# Altium schematic sheet GSM.SchDoc
size A3
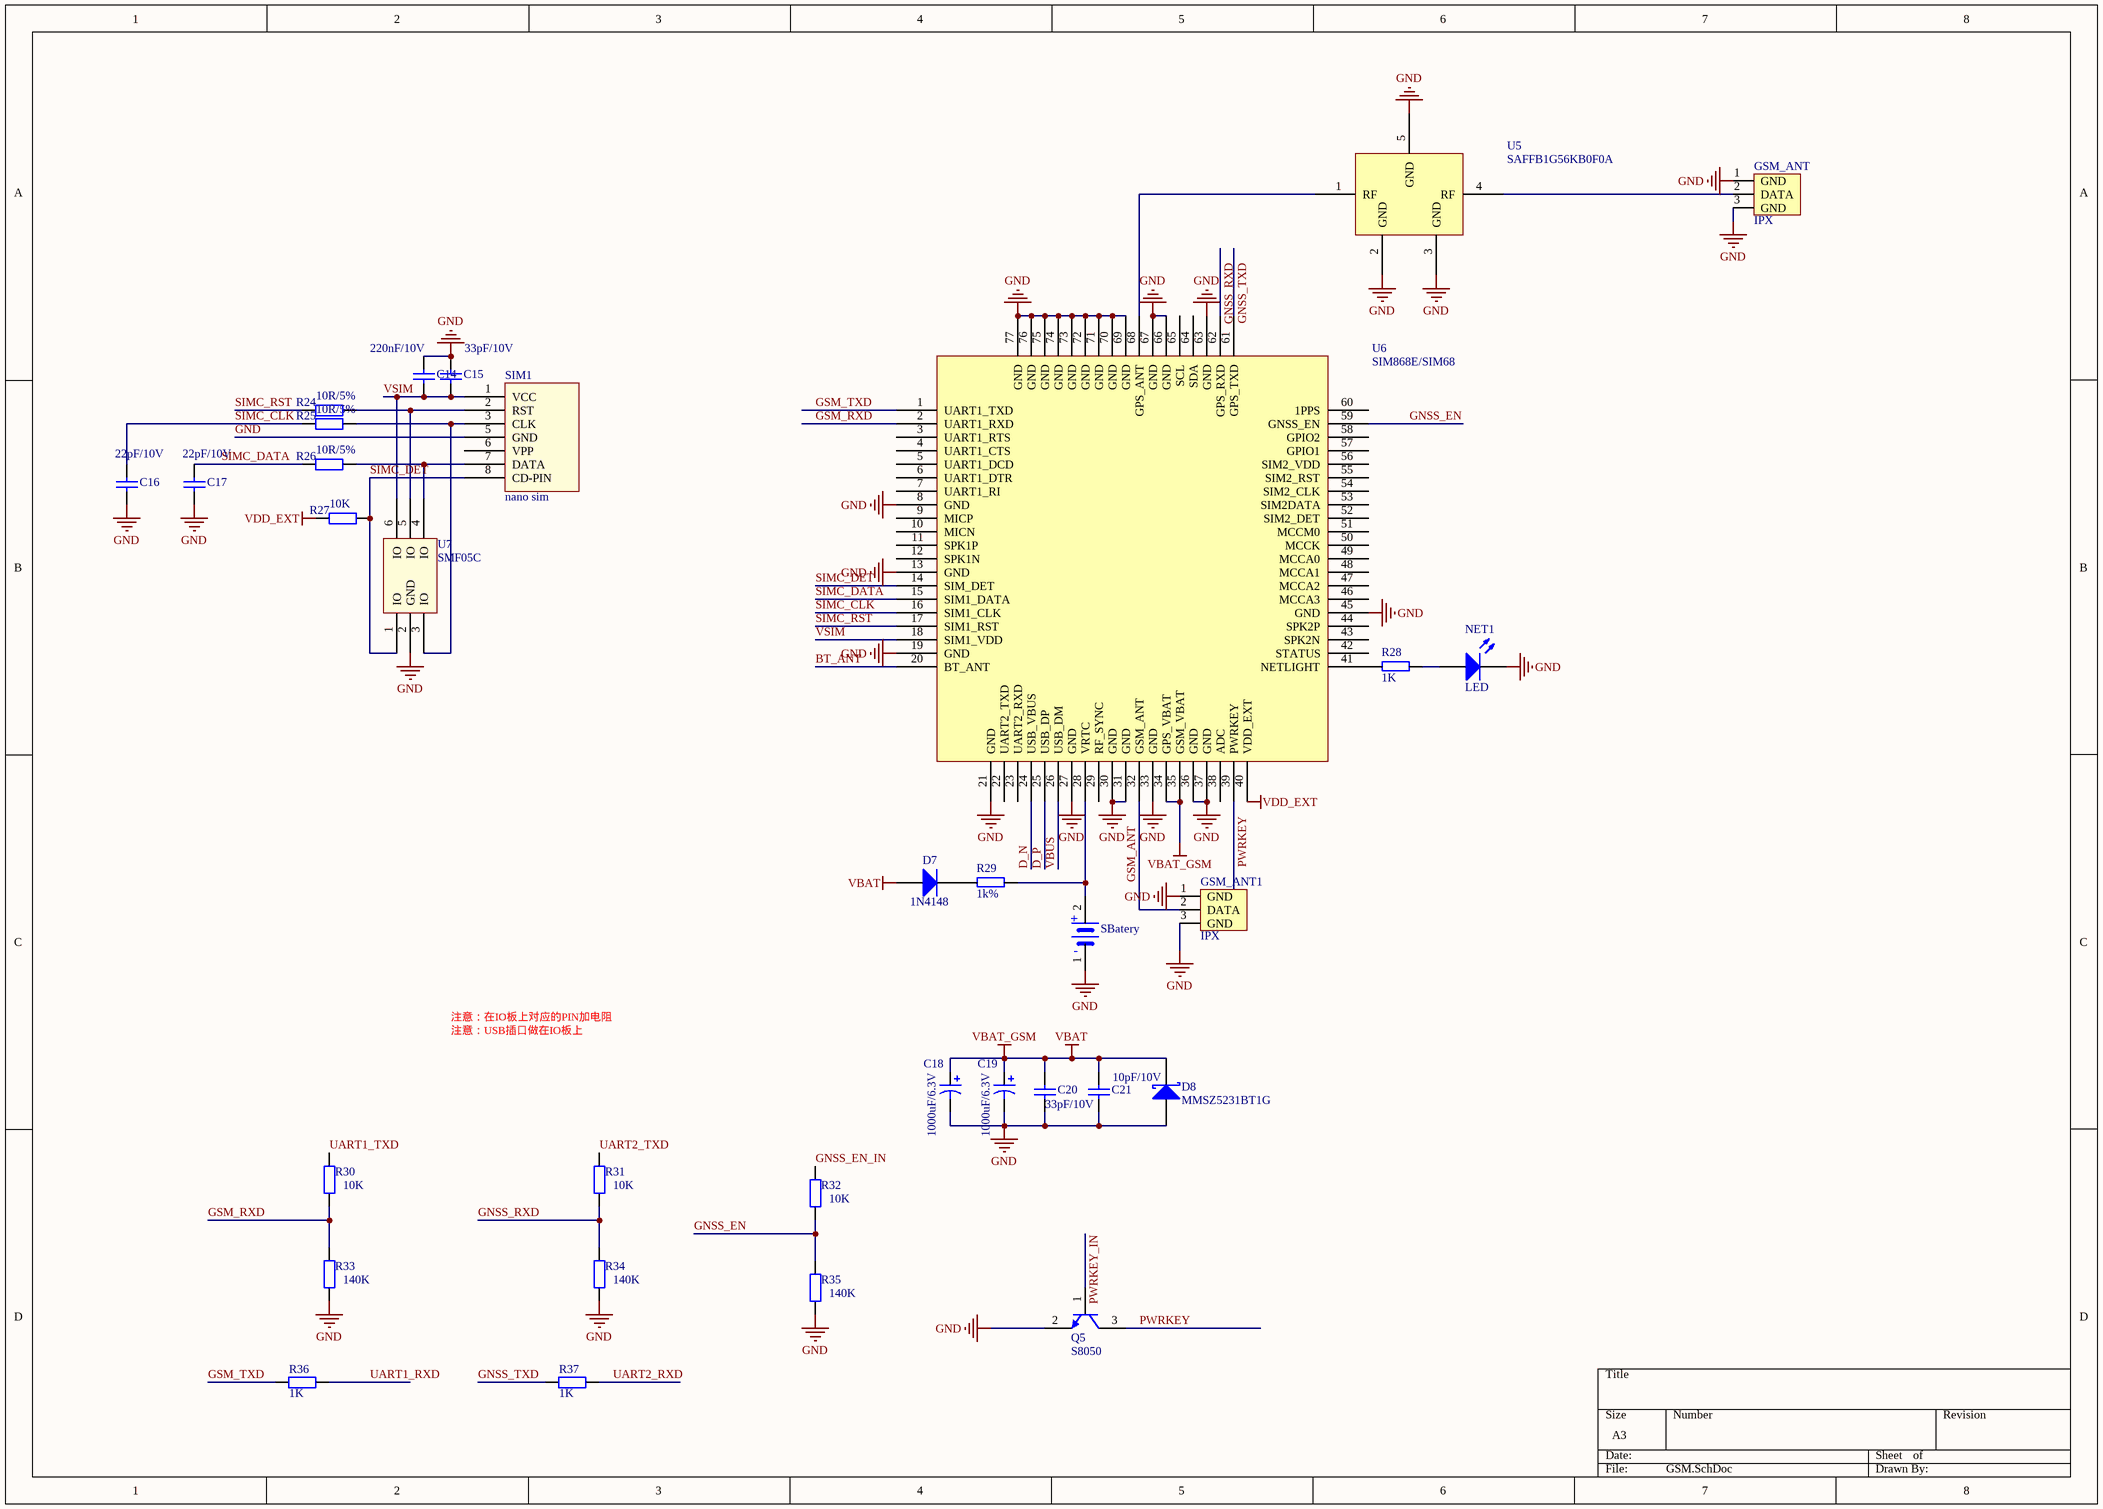
[diagram p0: GSM.SchDoc]

## Parts
C14  220nF/10V  [0402C]
C15  33pF/10V  [0402C]
C16  22pF/10V  [0402C]
C17  22pF/10V  [0402C]
C18  1000uF/6.3V  [7343]
C19  1000uF/6.3V  [7343]
C20  33pF/10V  [0402C]
C21  10pF/10V  [0402C]
D7  1N4148  [sod323]
D8  MMSZ5231BT1G  [SOD123]
GSM_ANT  IPX  [IPX]
GSM_ANT1  IPX  [IPX]
NET1  LED  [0603LED]
Q5  S8050  [SOT23-3]
R24  10R/5%  [0402R]
R25  10R/5%  [0402R]
R26  10R/5%  [0402R]
R27  10K  [0402R]
R28  1K  [0402R]
R29  1k%  [0402R]
R30  10K  [0402R]
R31  10K  [0402R]
R32  10K  [0402R]
R33  140K  [0402R]
R34  140K  [0402R]
R35  140K  [0402R]
R36  1K  [0402R]
R37  1K  [0402R]
SBatery  SBatery  [MS621FE]  (value not drawn)
SIM1  nano sim  [Nano SIM]
U5  SAFFB1G56KB0F0A  [SAFFB1G56KB0F0A]
U6  SIM868E/SIM68  [SIM868]
U7  SMF05C  [SC70-6L]

## Nets
GND: C14.1 C15.1 C16.2 C17.2 C18.2 C19.2 C20.2 C21.2 D8.A GSM_ANT.1(GND) GSM_ANT.3(GND) GSM_ANT1.1(GND) GSM_ANT1.3(GND) NET1.2(K) Q5.2(E) R33.2 R34.2 R35.2 SBatery.1 SIM1.5(GND) U5.2(GND) U5.3(GND) U5.5(GND) U6.8(GND) U6.13(GND) U6.19(GND) U6.21(GND) U6.27(GND) U6.30(GND) U6.31(GND) U6.33(GND) U6.36(GND) U6.37(GND) U6.45(GND) U6.63(GND) U6.66(GND) U6.67(GND) U6.69(GND) U6.70(GND) U6.71(GND) U6.72(GND) U6.73(GND) U6.74(GND) U6.75(GND) U6.76(GND) U6.77(GND) U7.2(GND)
VBAT: C18.1 C19.1 C20.1 C21.1 D7.A D8.K U6.34(GPS_VBAT) U6.35(GSM_VBAT)  [also labelled VBAT_GSM]
VDD_EXT: R27.2 U6.40(VDD_EXT)
BT_ANT: U6.20(BT_ANT)
D_N: U6.24(USB_VBUS)
D_P: U6.25(USB_DP)
GNSS_EN: R32.2 R35.1 U6.59(GNSS_EN)
GNSS_EN_IN: R32.1
GNSS_RXD: R31.2 R34.1 U6.62(GPS_RXD)
GNSS_TXD: R37.1 U6.61(GPS_TXD)
GSM_ANT: GSM_ANT1.2(DATA) U6.32(GSM_ANT)
GSM_RXD: R30.2 R33.1 U6.2(UART1_RXD)
GSM_TXD: R36.1 U6.1(UART1_TXD)
PWRKEY: Q5.3(C) U6.39(PWRKEY)
PWRKEY_IN: Q5.1(B)
SIMC_CLK: C16.1 R25.2 U6.16(SIM1_CLK)
SIMC_DATA: C17.1 R26.2 U6.15(SIM1_DATA)
SIMC_DET: R27.1 SIM1.8(CD-PIN) U6.14(SIM_DET) U7.1(IO)
SIMC_RST: R24.2 U6.17(SIM1_RST)
UART1_RXD: R36.2
UART1_TXD: R30.1
UART2_RXD: R37.2
UART2_TXD: R31.1
VBUS: U6.26(USB_DM)
VSIM: C14.2 C15.2 SIM1.1(VCC) U6.18(SIM1_VDD) U7.6(IO)
NetD7_K: D7.K R29.2
NetGSM_ANT_2: GSM_ANT.2(DATA) U5.4(RF)
NetNET1_1: NET1.1(A) R28.1
NetR24_1: R24.1 SIM1.2(RST) U7.5(IO)
NetR25_1: R25.1 SIM1.3(CLK) U7.3(IO)
NetR26_1: R26.1 SIM1.7(DATA) U7.4(IO)
NetR28_2: R28.2 U6.41(NETLIGHT)
NetR29_1: R29.1 SBatery.2 U6.28(VRTC)
NetU5_1: U5.1(RF) U6.68(GPS_ANT)

Not connected (* = marked no-connect by the designer): SIM1 6(VPP); U6 3(UART1_RTS) 4(UART1_CTS) 5(UART1_DCD) 6(UART1_DTR) 7(UART1_RI) 9(MICP) 10(MICN) 11(SPK1P) 12(SPK1N) 22(UART2_TXD) 23(UART2_RXD) 29(RF_SYNC) 38(ADC) 42(STATUS) 43(SPK2N) 44(SPK2P) 46(MCCA3) 47(MCCA2) 48(MCCA1) 49(MCCA0) 50(MCCK) 51(MCCM0) 52(SIM2_DET) 53(SIM2DATA) 54(SIM2_CLK) 55(SIM2_RST) 56(SIM2_VDD) 57(GPIO1) 58(GPIO2) 60(1PPS) 64(SDA) 65(SCL)

## Notes on the sheet
- 注意：在IO板上对应的PIN加电阻
- 注意：USB插口做在IO板上
- (in symbol SBatery) +; -

## Library data of the parts
C14-C17 C20 C21 = Cap: Capacitor; Value: 0.1uF/10V; Published: 8-Jun-2000; LatestRevisionDate: 17-Jul-2002; LatestRevisionNote: Re-released for DXP Platform.; PackageReference: RAD-0.3; Publisher: Altium Limited
C18 C19 = Cap Pol1: Polarized Capacitor (Radial); Published: 8-Jun-2000; LatestRevisionDate: 17-Jul-2002; LatestRevisionNote: Re-released for DXP Platform.; PackageReference: RB7.6-15; Publisher: Altium Limited
D7 = Diode 1N4148: High Conductance Fast Diode; Published: 8-Jun-2000; LatestRevisionDate: 17-Jul-2002; LatestRevisionNote: Re-released for DXP Platform.; DatasheetVersion: 1997; PackageReference: DO-35; Publisher: Altium Limited; Code_JEDEC: DO-204-AH; ComponentLink1Description: Manufacturer Link; ComponentLink1URL: http://www.fairchildsemi.com/; ComponentLink2Description: Datasheet; ComponentLink2URL: http://www.fairchildsemi.com/ds/1N%2F1N4148.pdf
D8 = Diode 10TQ040: Schottky Rectifier; Note: Terminal 2 is the TAB and is electrically connected to the cathode; Published: 8-Jun-2000; LatestRevisionDate: 17-Jul-2002; LatestRevisionNote: Re-released for DXP Platform.; DatasheetVersion: PD-2.057B; PackageVersion: Feb-1998; PackageReference: TO-220AC; Publisher: Altium Limited; ComponentLink1Description: Manufacturer Link; ComponentLink1URL: http://www.irf.com/
GSM_ANT GSM_ANT1 = IPEX: IPEX座
NET1 = LED2: Typical RED, GREEN, YELLOW, AMBER GaAs LED; Published: 8-Jun-2000; LatestRevisionDate: 17-Jul-2002; LatestRevisionNote: Re-released for DXP Platform.; PackageDocument: Feb-2002; PackageReference: 3.2X1.6X1.1; Publisher: Altium Limited
Q5 = NPN
R24-R27 = Res2: Resistor; Value: 10R; Published: 8-Jun-2000; LatestRevisionDate: 17-Jul-2002; LatestRevisionNote: Re-released for DXP Platform.; PackageReference: AXIAL-0.4; Publisher: Altium Limited
R28 R29 = R
R30-R37 = Res2: Resistor; Value: 0; Published: 8-Jun-2000; LatestRevisionDate: 17-Jul-2002; LatestRevisionNote: Re-released for DXP Platform.; PackageReference: AXIAL-0.4; Publisher: Altium Limited
U5 = SAFFB1G56KBOFA
U6 = SIM868E/SIM868